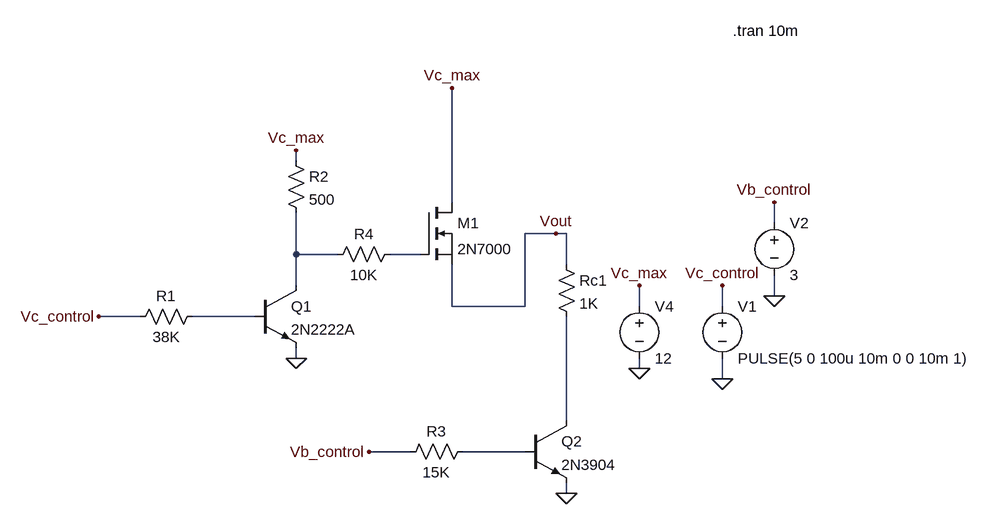
[diagram p0: schematic NPN FET Configuration 2.asc]
NPN FET Configuration 2.asc, the LTspice schematic file:
Version 4
SHEET 1 1664 804
WIRE 208 -192 208 -208
WIRE 448 -128 448 -304
WIRE 944 -96 944 -128
WIRE 608 -80 560 -80
WIRE 624 -80 608 -80
WIRE 208 -48 208 -112
WIRE 272 -48 208 -48
WIRE 400 -48 352 -48
WIRE 624 -32 624 -80
WIRE 208 0 208 -48
WIRE 944 16 944 -16
WIRE 448 32 448 -32
WIRE 560 32 560 -80
WIRE 560 32 448 32
WIRE 736 32 736 0
WIRE 864 32 864 0
WIRE -32 48 -96 48
WIRE 144 48 48 48
WIRE 208 112 208 96
WIRE 736 128 736 112
WIRE 864 144 864 112
WIRE 624 208 624 48
WIRE 384 256 320 256
WIRE 560 256 464 256
WIRE 624 320 624 304
FLAG 736 128 0
FLAG 736 0 Vc_max
FLAG 864 144 0
FLAG 864 0 Vc_control
FLAG 448 -304 Vc_max
FLAG -96 48 Vc_control
FLAG 608 -80 Vout
FLAG 208 -208 Vc_max
FLAG 208 112 0
FLAG 624 320 0
FLAG 944 16 0
FLAG 944 -128 Vb_control
FLAG 320 256 Vb_control
SYMBOL voltage 736 16 R0
WINDOW 123 0 0 Left 2
WINDOW 39 0 0 Left 2
SYMATTR InstName V4
SYMATTR Value 12
SYMBOL voltage 864 16 R0
WINDOW 123 0 0 Left 2
WINDOW 39 0 0 Left 2
SYMATTR InstName V1
SYMATTR Value PULSE(5 0 100u 10m 0 0 10m 1)
SYMBOL res 608 -48 R0
SYMATTR InstName Rc1
SYMATTR Value 1K
SYMBOL nmos 400 -128 R0
SYMATTR InstName M1
SYMATTR Value 2N7000
SYMBOL res 192 -208 R0
SYMATTR InstName R2
SYMATTR Value 500
SYMBOL npn 144 0 R0
SYMATTR InstName Q1
SYMATTR Value 2N2222A
SYMBOL res 64 32 R90
WINDOW 0 0 56 VBottom 2
WINDOW 3 32 56 VTop 2
SYMATTR InstName R1
SYMATTR Value 38K
SYMBOL npn 560 208 R0
SYMATTR InstName Q2
SYMATTR Value 2N3904
SYMBOL res 480 240 R90
WINDOW 0 0 56 VBottom 2
WINDOW 3 32 56 VTop 2
SYMATTR InstName R3
SYMATTR Value 15K
SYMBOL voltage 944 -112 R0
WINDOW 123 0 0 Left 2
WINDOW 39 0 0 Left 2
SYMATTR InstName V2
SYMATTR Value 3
SYMBOL res 368 -64 R90
WINDOW 0 0 56 VBottom 2
WINDOW 3 32 56 VTop 2
SYMATTR InstName R4
SYMATTR Value 10K
TEXT 880 -392 Left 2 !.tran 10m

The netlist it stands for:
* NPN FET Configuration 2.asc
V4 Vc_max 0 12
V1 Vc_control 0 PULSE(5 0 100u 10m 0 0 10m 1)
Rc1 Vout N004 1K
M1 Vc_max N002 Vout Vout 2N7000
R2 Vc_max N001 500
Q1 N001 N003 0 0 2N2222A
R1 N003 Vc_control 38K
Q2 N004 N005 0 0 2N3904
R3 N005 Vb_control 15K
V2 Vb_control 0 3
R4 N002 N001 10K
.model NPN NPN
.model PNP PNP
.lib standard.bjt
.model NMOS NMOS
.model PMOS PMOS
.lib standard.mos
.tran 10m
.backanno
.end